# Altium schematic sheet power_supply.SchDoc
size A4; Author: Mikołaj Pichita; CompanyName: AGH University of Science and Technology; SheetNumber: 9; SheetTotal: 16
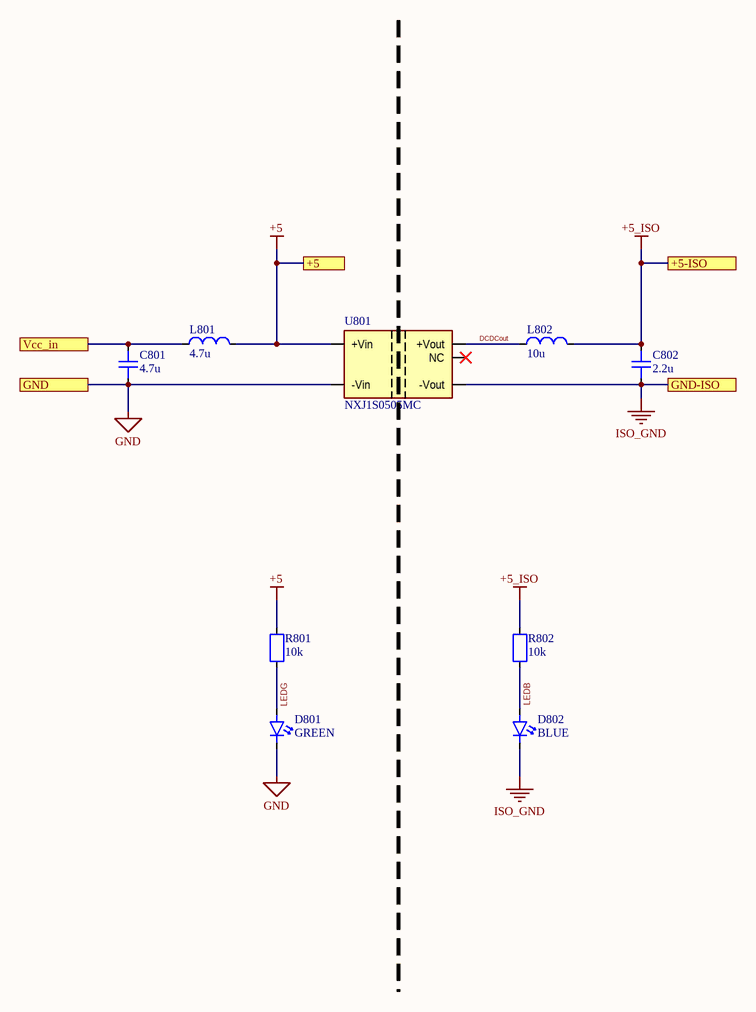
[diagram p0: power_supply.SchDoc]

## Parts
C801  4.7u  [CAP0603]
C802  2.2u  [CAP0603]
D801  GREEN  [LED0603]
D802  BLUE  [LED0603]
L801  4.7u  [FP-8200-MFG]
L802  10u  [FP-8200-MFG]
R801  10k  [RES0603]
R802  10k  [RES0603]
U801  NXJ1S0505MC  [NXJ1]

## Ports
+5 (see main[1B], choke_current_meas[4B], current_sense_shunt[4A], full_bridge[1C], isolator[1B], measurements[1C], microcontroller[1C], voltage_sense[4A]), +5-ISO (see main[1B], full_bridge[1B], isolator[4B], measurements[1B], OV_OC[1B], testpoint[2A]), GND (see main[1B], choke_current_meas[4B], current_sense_shunt[4B], full_bridge[1D], isolator[1B], measurements[1C], microcontroller[1C], voltage_sense[4B]), GND-ISO (see main[1B], full_bridge[1B], input_filter[2C], isolator[4B], measurements[1B], output_filter[1B], OV_OC[1B], testpoint[2A], voltage_sense[1B]), Vcc_in (see main[1B])

## Nets
+5: L801.2 R801.1 U801.3(+Vin) ; port +5
+5_ISO: C802.1 L802.2 R802.1 ; port +5-ISO
GND: C801.2 D801.2 U801.1(-Vin) ; port GND
ISO_GND: C802.2 D802.2 U801.7(-Vout) ; port GND-ISO
DCDCout: L802.1 U801.8(+Vout)
LEDB: D802.1 R802.2
LEDG: D801.1 R801.2
Vcc_in: C801.1 L801.1 ; port Vcc_in

Not connected (* = marked no-connect by the designer): U801 14(NC)*

## Notes on the sheet
- Nazwa projektu
- Nazwa dokumentu
- Nazwa firmy:
- Autor:
- Osoba sprawdzająca:
- Data:

## Library data of the parts
C801 C802 = Capacitor: Value: *; HelpURL: *; MPN: *; Supplier: *; SupplierPartNumber: *; Supplier 1: Mouser; Supplier Part Number 1: 581-06033D475KAT2A
D801 D802 = LED: Value: *; HelpURL: *; MPN: *; Supplier: *; SupplierPartNumber: *; Supplier 1: Mouser
  D801: Supplier Part Number 1: 604-APTD1608LZGCK
  D802: Supplier Part Number 1: 604-APTD1608LVBCD
L801 L802 = Inductor: Value: *; HelpURL: *; MPN: *; Supplier: *; SupplierPartNumber: *; Supplier 1: Mouser
  L801: Supplier Part Number 1: 580-82472C
  L802: Supplier Part Number 1: 580-82103C
R801 R802 = Resistor: Value: *; HelpURL: *; MPN: *; Supplier: *; SupplierPartNumber: *; Supplier 1: Mouser; Supplier Part Number 1: 603-RT0603DRE0716K5L
U801 = NXJ1S0505MC: Isolated DC/DC Converters - SMD SM 1W 5V-5V SINGLE 4.2KV; Value: *; HelpURL: *; MPN: *; Supplier: *; SupplierPartNumber: *; Supplier 1: Mouser; Supplier Part Number 1: 580-NXJ1S0505MC-R13